# EAGLE schematic 4069-Twin-T-Drums (EAGLE 7.2.0)
Twin-T Analog Drum Voice using CD40106
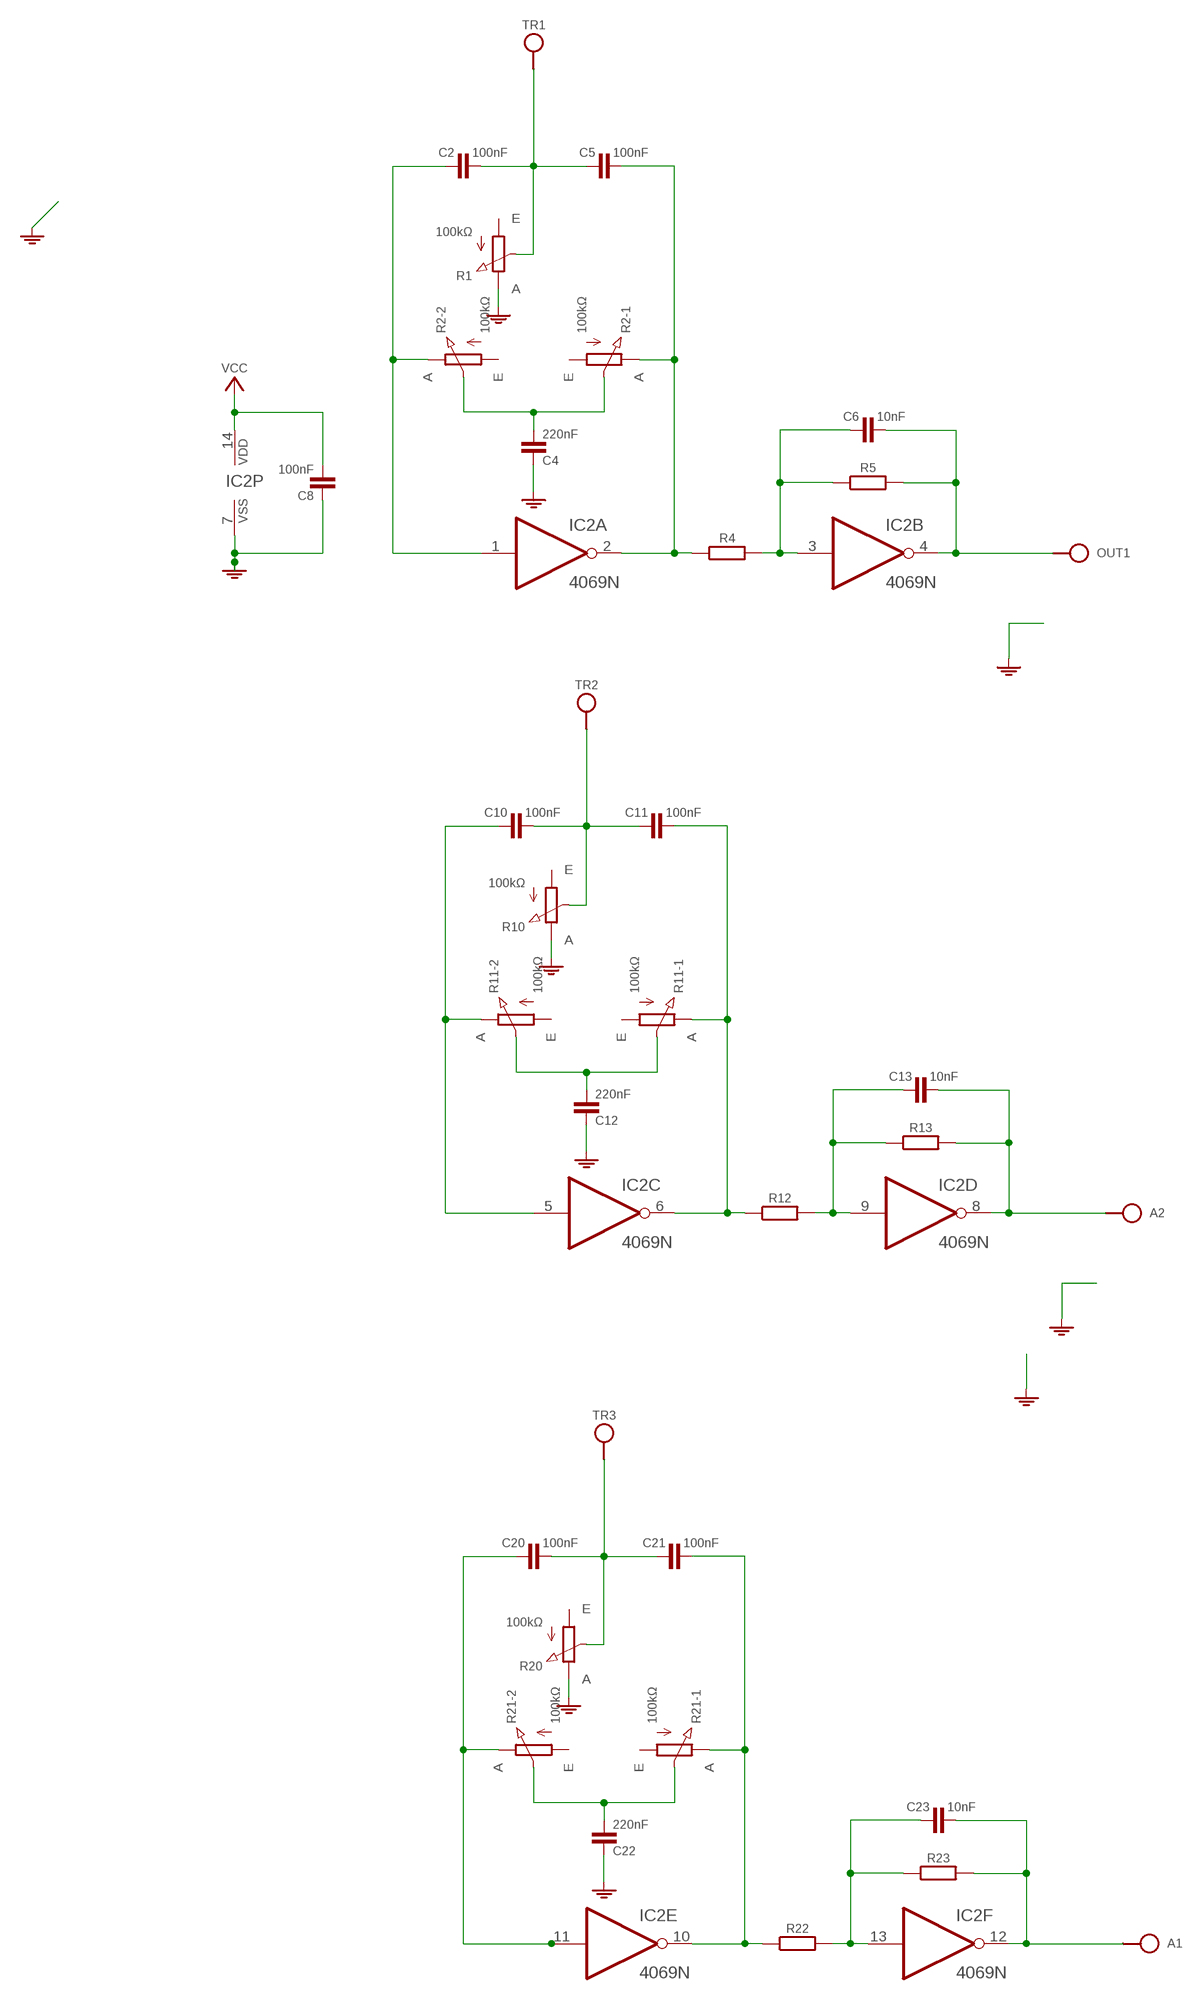
[diagram p0: schematic, sheet 1]

## Parts
A1  HPORT  [SPAD]
A2  HPORT  [SPAD]
C2  100nF  C-H050-020X044  [C050-020X044]
C4  220nF  C050-020X044/V  [C050-020X044/V]
C5  100nF  C-H050-020X044  [C050-020X044]
C6  10nF  C-H025-015X024  [C025-015X024]
C8  100nF  C050-020X044/V  [C050-020X044/V]
C10  100nF  C-H050-020X044  [C050-020X044]
C11  100nF  C-H050-020X044  [C050-020X044]
C12  220nF  C050-020X044/V  [C050-020X044/V]
C13  10nF  C-H025-015X024  [C025-015X024]
C20  100nF  C-H050-020X044  [C050-020X044]
C21  100nF  C-H050-020X044  [C050-020X044]
C22  220nF  C050-020X044/V  [C050-020X044/V]
C23  10nF  C-H025-015X024  [C025-015X024]
IC2  4069N  [DIL14]
OUT1  HPORT  [SPAD]
R1  100kΩ  POT  [POT]
R2  100kΩ  POT-STEREO  [POT-STEREO-2X3]
R4  R-H0202/2V  [0202/2V]
R5  R-H0202/2V  [0202/2V]
R10  100kΩ  POT  [POT]
R11  100kΩ  POT-STEREO  [POT-STEREO-2X3]
R12  R-H0202/2  [0202/2]
R13  R-H0202/2V  [0202/2V]
R20  100kΩ  POT  [POT]
R21  100kΩ  POT-STEREO  [POT-STEREO-2X3]
R22  R-H0202/2V  [0202/2V]
R23  R-H0202/2V  [0202/2V]
S12  VCC_GNDPWR-L  [PWR-L]
TR1  VPORT  [SPAD]
TR2  VPORT  [SPAD]
TR3  VPORT  [SPAD]

## Nets
DR1: C4.2 R2.1-S(-1:S) R2.2-S(-2:S)
DR2: C12.2 R11.1-S(-1:S) R11.2-S(-2:S)
DR3: C22.2 R21.1-S(-1:S) R21.2-S(-2:S)
GND: C4.1 C8.1 C12.1 C22.1 IC2.7(P:VSS) R1.E R10.E R20.E S12.1
I1: C2.1 IC2.1(A:I) R2.2-E(-2:E)
I2: C6.1 IC2.3(B:I) R4.2 R5.1
I3: C10.1 IC2.5(C:I) R11.2-E(-2:E)
I4: C13.1 IC2.9(D:I) R12.2 R13.1
I5: C20.1 IC2.11(E:I) R21.2-E(-2:E)
I6: C23.1 IC2.13(F:I) R22.2 R23.1
O1: C5.2 IC2.2(A:O) R2.1-E(-1:E) R4.1
O2: C6.2 IC2.4(B:O) OUT1.1 R5.2
O3: C11.2 IC2.6(C:O) R11.1-E(-1:E) R12.1
O4: A2.1 C13.2 IC2.8(D:O) R13.2
O5: C21.2 IC2.10(E:O) R21.1-E(-1:E) R22.1
O6: A1.1 C23.2 IC2.12(F:O) R23.2
TR1: C2.2 C5.1 R1.S TR1.1
TR2: C10.2 C11.1 R10.S TR2.1
TR3: C20.2 C21.1 R20.S TR3.1
VCC: C8.2 IC2.14(P:VDD) S12.2
Unconnected: R1.A R2.1-A(-1:A) R2.2-A(-2:A) R10.A R11.1-A(-1:A) R11.2-A(-2:A) R20.A R21.1-A(-1:A) R21.2-A(-2:A)

## Library data of the parts
A1 A2 OUT1 = pad:HPORT
C2 C5 C6 C10 C11 C13 C20 C21 C23 = c:C-H
C4 C8 C12 C22 = c:C: CAPACITOR, European symbol
IC2 = ic:4069: Hex INVERTER
R1 R10 R20 = r:POT
R2 R11 R21 = r:POT-STEREO
R4 R5 R12 R13 R22 R23 = r:R-H
S12 = pad:VCC_GND
TR1-TR3 = pad:VPORT

## Net classes
0 default: width 0.61 mm, clearance 0.305 mm